# Altium schematic sheet Tray2_BCR.SchDoc: BLUEsat solar battery charge regulator subystem
size A2; Engineer: Thomas Fisk; Organization: BLUEsat Project; Address1: Room 419; Address2: School of EE&T; Address3: UNSW, NSW 2052; Address4: Australia; DocumentNumber: POWR0008; SheetNumber: 1; SheetTotal: 1; Description: Solar battery charge regulator subsystem.; Version: 2.6; PageSetup: Record=PageOptions|CenterHorizontal=True|CenterVertical=True|PrintScale=0.71|XCorrection=1.00|YCorrection=1.00|PrintKind=1|BorderSize=5000000|LeftOffset=0|BottomOffset=0|Orientation=2|PaperLength=2970|PaperWidth=2100|Scale=100|PaperSource=7|PrintQuality=1200|MediaType=1|DitherType=10|PaperKind=A4|PrintScaleMode=1
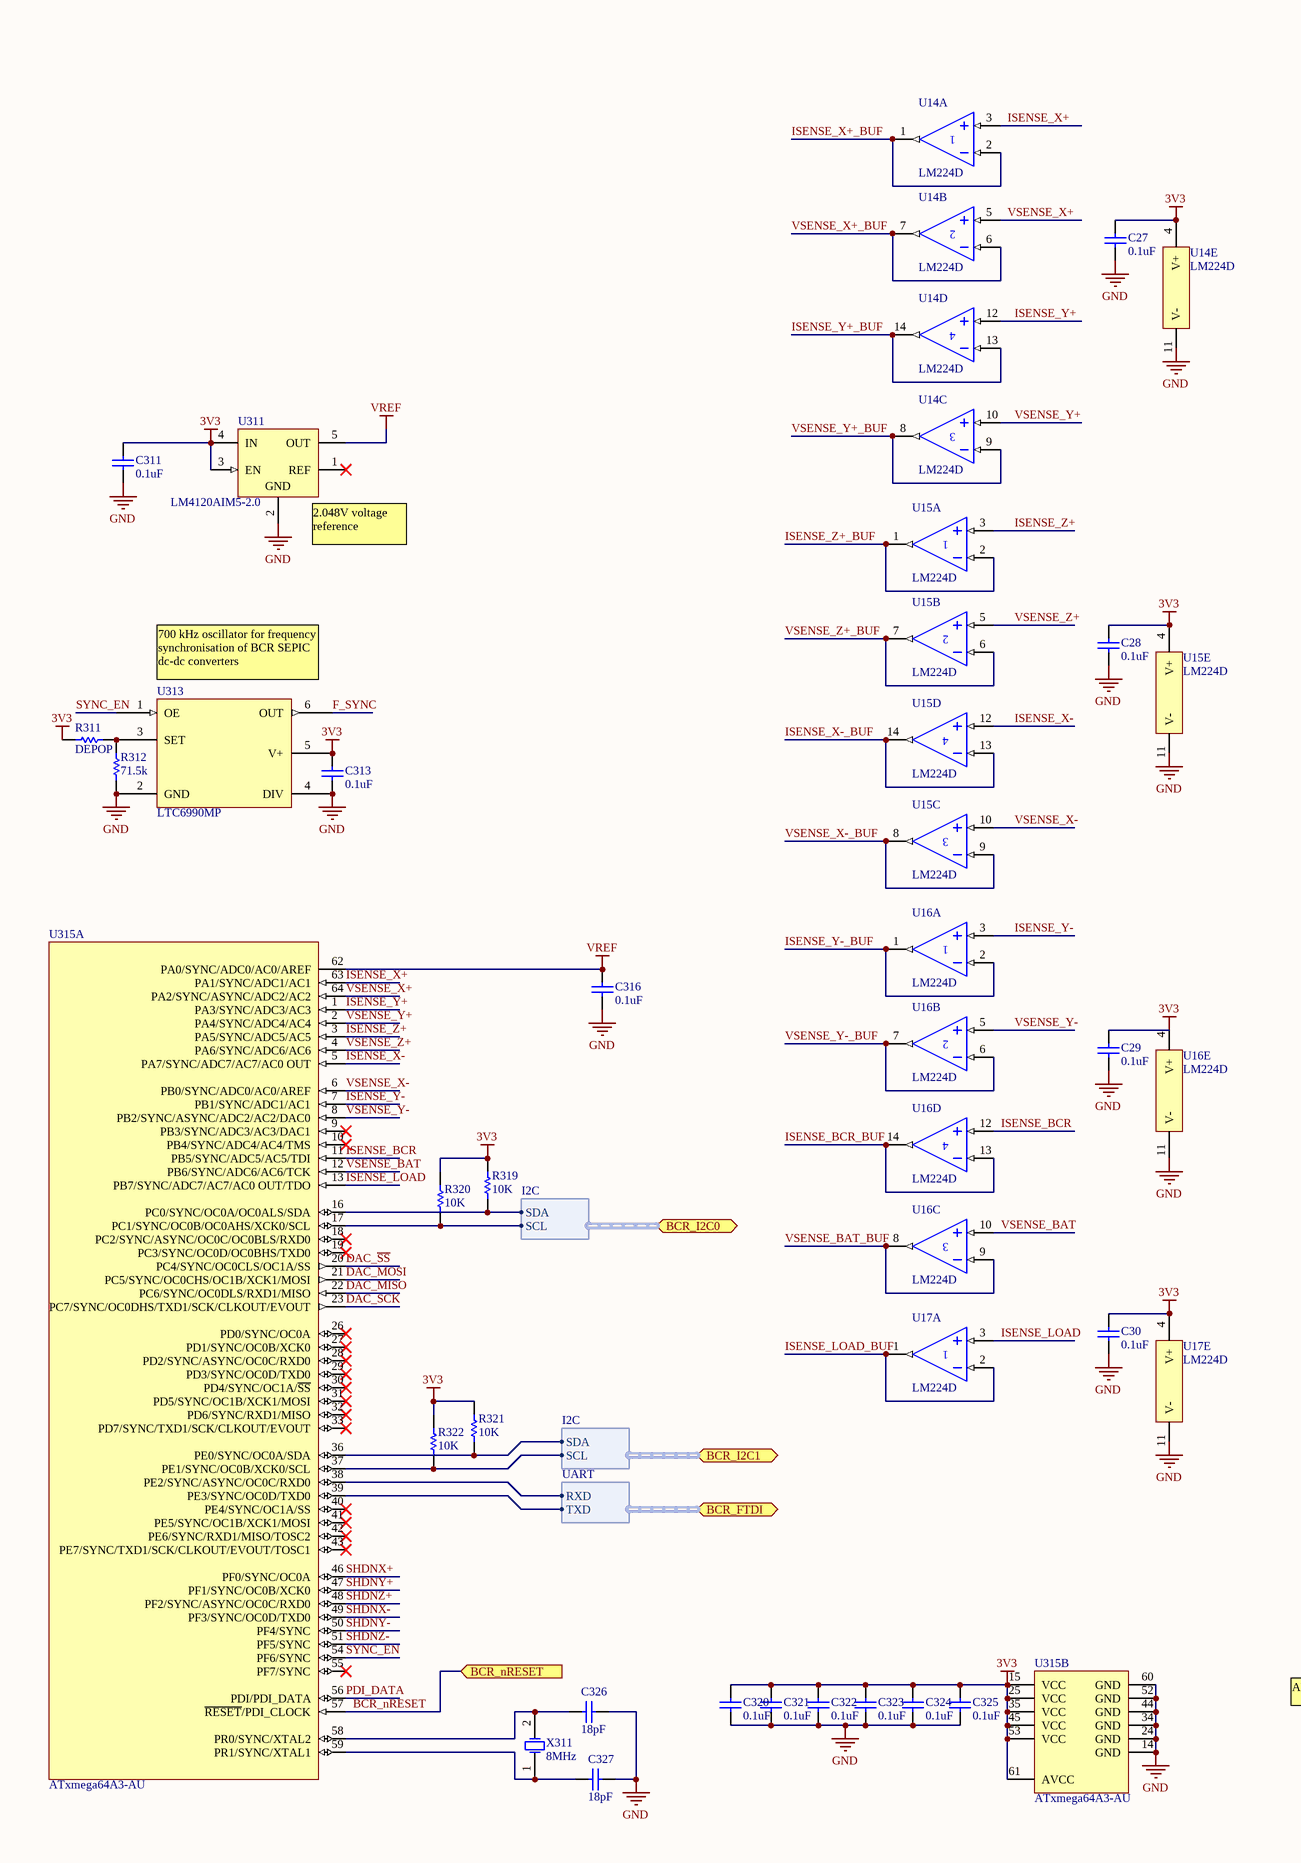
[diagram p0: Tray2_BCR.SchDoc, left]
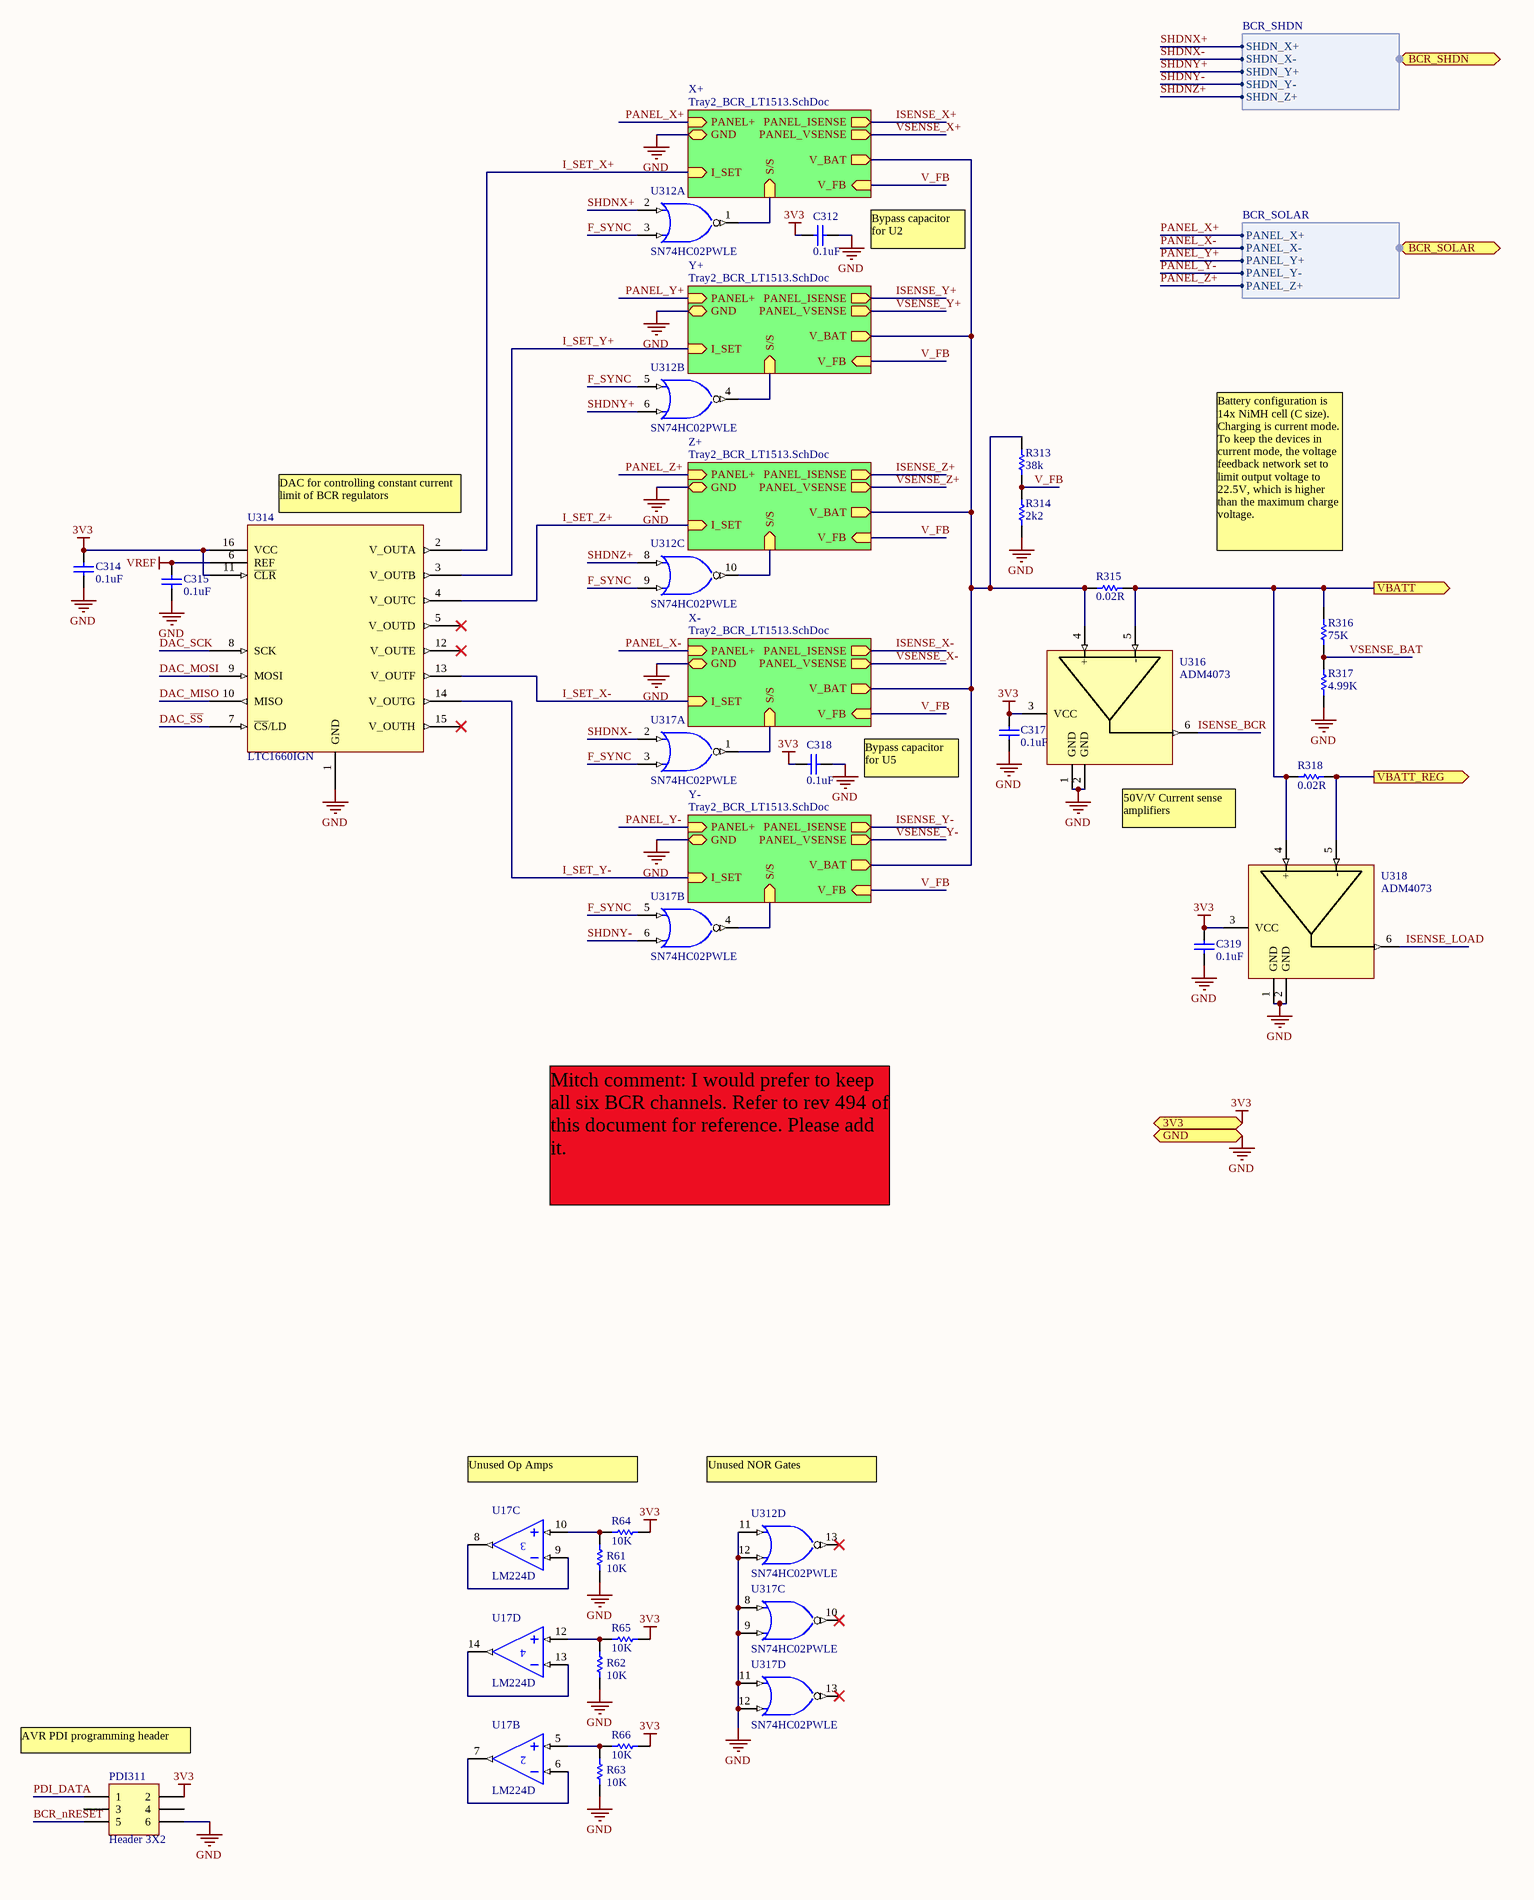
[diagram p1: Tray2_BCR.SchDoc, right]

## Parts
C27  value 0.1uF  [CAPC2012M]  (hidden comment: Cap)
C28  value 0.1uF  [CAPC2012M]  (hidden comment: Cap)
C29  value 0.1uF  [CAPC2012M]  (hidden comment: Cap)
C30  value 0.1uF  [CAPC2012M]  (hidden comment: Cap)
C311  value 0.1uF  [CAPC2012M]  (hidden comment: Cap)
C312  value 0.1uF  [CAPC2012M]  (hidden comment: Cap)
C313  value 0.1uF  [CAPC2012M]  (hidden comment: Cap)
C314  value 0.1uF  [CAPC2012M]  (hidden comment: Cap)
C315  value 0.1uF  [CAPC2012M]  (hidden comment: Cap)
C316  value 0.1uF  [CAPC2012M]  (hidden comment: Cap)
C317  value 0.1uF  [CAPC2012M]  (hidden comment: Cap)
C318  value 0.1uF  [CAPC2012M]  (hidden comment: Cap)
C319  value 0.1uF  [CAPC2012M]  (hidden comment: Cap)
C320  value 0.1uF  [CAPC2012M]  (hidden comment: Cap)
C321  value 0.1uF  [CAPC2012M]  (hidden comment: Cap)
C322  value 0.1uF  [CAPC2012M]  (hidden comment: Cap)
C323  value 0.1uF  [CAPC2012M]  (hidden comment: Cap)
C324  value 0.1uF  [CAPC2012M]  (hidden comment: Cap)
C325  value 0.1uF  [CAPC2012M]  (hidden comment: Cap)
C326  value 18pF  [CAPC2012M]  (hidden comment: Cap)
C327  value 18pF  [CAPC2012M]  (hidden comment: Cap)
PDI311  Header 3X2  [HDR2X3]
R61  value 10K  [RESC2012M]  (hidden comment: Res1)
R62  value 10K  [RESC2012M]  (hidden comment: Res1)
R63  value 10K  [RESC2012M]  (hidden comment: Res1)
R64  value 10K  [RESC2012M]  (hidden comment: Res1)
R65  value 10K  [RESC2012M]  (hidden comment: Res1)
R66  value 10K  [RESC2012M]  (hidden comment: Res1)
R311  value DEPOP  [RESC2012M]  (hidden comment: Res1)
R312  value 71.5k  [RESC2012M]  (hidden comment: Res1)
R313  value 38k  [RESC2012M]  (hidden comment: Res1)
R314  value 2k2  [RESC2012M]  (hidden comment: Res1)
R315  value 0.02R  [RESC2012M]  (hidden comment: 0805 Resistor)
R316  value 75K  [RESC2012M]  (hidden comment: Res1)
R317  value 4.99K  [RESC2012M]  (hidden comment: Res1)
R318  value 0.02R  [RESC2012M]  (hidden comment: 0805 Resistor)
R319  value 10K  [RESC2012M]  (hidden comment: Res1)
R320  value 10K  [RESC2012M]  (hidden comment: Res1)
R321  value 10K  [RESC2012M]  (hidden comment: Res1)
R322  value 10K  [RESC2012M]  (hidden comment: Res1)
U14  LM224D  [D014_N]  (parts A,B,C,D,E of 5)
U15  LM224D  [D014_N]  (parts A,B,C,D,E of 5)
U16  LM224D  [D014_N]  (parts A,B,C,D,E of 5)
U17  LM224D  [D014_N]  (parts A,B,C,D,E of 5)
U311  LM4120AIM5-2.0  [MF05A_N]
U312  SN74HC02PWLE  [TSOP65P640-14AN]  (parts A,B,C,D of 4)
U313  LTC6990MP  [SOT26A-6L]
U314  LTC1660IGN  [SOP635P600-16N]
U315  ATxmega64A3-AU  [64A_N]  (parts A,B of 2)
U316  ADM4073  [SOT26A-6N]
U317  SN74HC02PWLE  [TSOP65P640-14AN]  (parts A,B,C,D of 4)
U318  ADM4073  [SOT26A-6N]
X311  8MHz  [HC49 - No border]

## Sub-sheets
X+ = Tray2_BCR_LT1513.SchDoc: I_SET (in), V_BAT, S/S (in), V_FB (in), PANEL_VSENSE (out), PANEL_ISENSE (out), PANEL+ (in), GND
X- = Tray2_BCR_LT1513.SchDoc: I_SET (in), V_BAT, S/S (in), V_FB (in), PANEL_VSENSE (out), PANEL_ISENSE (out), PANEL+ (in), GND
Y+ = Tray2_BCR_LT1513.SchDoc: I_SET (in), V_BAT, S/S (in), V_FB (in), PANEL_VSENSE (out), PANEL_ISENSE (out), PANEL+ (in), GND
Y- = Tray2_BCR_LT1513.SchDoc: I_SET (in), V_BAT, S/S (in), V_FB (in), PANEL_VSENSE (out), PANEL_ISENSE (out), PANEL+ (in), GND
Z+ = Tray2_BCR_LT1513.SchDoc: I_SET (in), V_BAT, S/S (in), V_FB (in), PANEL_VSENSE (out), PANEL_ISENSE (out), PANEL+ (in), GND

## Ports
3V3, BCR_FTDI (harness UART), BCR_I2C0 (harness I2C), BCR_I2C1 (harness I2C), BCR_nRESET (in), BCR_SHDN (harness BCR_SHDN), BCR_SOLAR (harness BCR_SOLAR), GND, VBATT (out), VBATT_REG (out)

## Harnesses
BCR_SHDN: SHDN_X+, SHDN_X-, SHDN_Y+, SHDN_Y-, SHDN_Z+
I2C: SCL, SDA
UART: RXD, TXD
BCR_SOLAR: PANEL_X+, PANEL_X-, PANEL_Y+, PANEL_Y-, PANEL_Z+

## Nets
3V3: C27.1 C28.1 C29.1 C30.1 C311.2 C312.2 C313.1 C314.2 C317.1 C318.2 C319.1 C320.2 C321.2 C322.2 C323.2 C324.2 C325.2 PDI311.2 R64.2 R65.2 R66.2 R311.1 R319.1 R320.1 R321.1 R322.1 U14.4(V+) U15.4(V+) U17.4(V+) U311.3(EN) U311.4(IN) U313.5(V+) U314.11(~{CLR}) U314.16(VCC) U315.15(VCC) U315.25(VCC) U315.35(VCC) U315.45(VCC) U315.53(VCC) U315.61(AVCC) U316.3(VCC) U318.3(VCC) ; port 3V3
GND: C27.2 C28.2 C29.2 C30.2 C311.1 C312.1 C313.2 C314.1 C315.1 C316.1 C317.2 C318.1 C319.2 C320.1 C321.1 C322.1 C323.1 C324.1 C325.1 C326.2 C327.1 PDI311.6 R61.2 R62.2 R63.2 R312.1 R314.1 R317.2 U16.11(V-) U311.2(GND) U312.7(GND) U312.11(A) U312.12(B) U313.2(GND) U313.4(DIV) U314.1(GND) U315.14(GND) U315.24(GND) U315.34(GND) U315.44(GND) U315.52(GND) U315.60(GND) U316.1(GND) U316.2(GND) U317.7(GND) U317.8(A) U317.9(B) U317.11(A) U317.12(B) U318.1(GND) U318.2(GND) ; port GND, sheet X+/GND, sheet Y+/GND, sheet Z+/GND, sheet X-/GND, sheet Y-/GND
VCC: U312.14(VCC) U317.14(VCC)
VREF: C315.2 C316.2 U311.5(OUT) U314.6(REF) U315.62(PA0/SYNC/ADC0/AC0/AREF)
BCR_nRESET: PDI311.5 U315.57(~{RESET}/PDI_CLOCK) ; port BCR_nRESET
DAC_MISO: U314.10(MISO) U315.22(PC6/SYNC/OC0DLS/RXD1/MISO)
DAC_MOSI: U314.9(MOSI) U315.21(PC5/SYNC/OC0CHS/OC1B/XCK1/MOSI)
DAC_~{SS}: U314.7(~{CS}/LD) U315.20(PC4/SYNC/OC0CLS/OC1A/SS)
DAC_SCK: U314.8(SCK) U315.23(PC7/SYNC/OC0DHS/TXD1/SCK/CLKOUT/EVOUT)
F_SYNC: U312.3(B) U312.5(A) U312.9(B) U313.6(OUT) U317.3(B) U317.5(A)
I_SET_X+: U314.2(V_OUTA) ; sheet X+/I_SET
I_SET_X-: U314.13(V_OUTF) ; sheet X-/I_SET
I_SET_Y+: U314.3(V_OUTB) ; sheet Y+/I_SET
I_SET_Y-: U314.14(V_OUTG) ; sheet Y-/I_SET
I_SET_Z+: U314.4(V_OUTC) ; sheet Z+/I_SET
ISENSE_BCR: U16.12(IN+) U315.11(PB5/SYNC/ADC5/AC5/TDI) U316.6
ISENSE_BCR_BUF: U16.13(IN-) U16.14(OUT)
ISENSE_LOAD: U17.3(IN+) U315.13(PB7/SYNC/ADC7/AC7/AC0_OUT/TDO) U318.6
ISENSE_LOAD_BUF: U17.1(OUT) U17.2(IN-)
ISENSE_X+: U14.3(IN+) U315.63(PA1/SYNC/ADC1/AC1) ; sheet X+/PANEL_ISENSE
ISENSE_X+_BUF: U14.1(OUT) U14.2(IN-)
ISENSE_X-: U15.12(IN+) U315.5(PA7/SYNC/ADC7/AC7/AC0_OUT) ; sheet X-/PANEL_ISENSE
ISENSE_X-_BUF: U15.13(IN-) U15.14(OUT)
ISENSE_Y+: U14.12(IN+) U315.1(PA3/SYNC/ADC3/AC3) ; sheet Y+/PANEL_ISENSE
ISENSE_Y+_BUF: U14.13(IN-) U14.14(OUT)
ISENSE_Y-: U16.3(IN+) U315.7(PB1/SYNC/ADC1/AC1) ; sheet Y-/PANEL_ISENSE
ISENSE_Y-_BUF: U16.1(OUT) U16.2(IN-)
ISENSE_Z+: U15.3(IN+) U315.3(PA5/SYNC/ADC5/AC5) ; sheet Z+/PANEL_ISENSE
ISENSE_Z+_BUF: U15.1(OUT) U15.2(IN-)
PANEL_X+: sheet X+/PANEL+, port BCR_SOLAR.PANEL_X+
PANEL_X-: sheet X-/PANEL+, port BCR_SOLAR.PANEL_X-
PANEL_Y+: sheet Y+/PANEL+, port BCR_SOLAR.PANEL_Y+
PANEL_Y-: sheet Y-/PANEL+, port BCR_SOLAR.PANEL_Y-
PANEL_Z+: sheet Z+/PANEL+, port BCR_SOLAR.PANEL_Z+
PDI_DATA: PDI311.1 U315.56(PDI/PDI_DATA)
SHDNX+: U312.2(A) U315.46(PF0/SYNC/OC0A) ; port BCR_SHDN.SHDN_X+
SHDNX-: U315.49(PF3/SYNC/OC0D/TXD0) U317.2(A) ; port BCR_SHDN.SHDN_X-
SHDNY+: U312.6(B) U315.47(PF1/SYNC/OC0B/XCK0) ; port BCR_SHDN.SHDN_Y+
SHDNY-: U315.50(PF4/SYNC) U317.6(B) ; port BCR_SHDN.SHDN_Y-
SHDNZ+: U312.8(A) U315.48(PF2/SYNC/ASYNC/OC0C/RXD0) ; port BCR_SHDN.SHDN_Z+
SHDNZ-: U315.51(PF5/SYNC)
SYNC_EN: U313.1(OE) U315.54(PF6/SYNC)
V_FB: R313.1 R314.2 ; sheet X+/V_FB, sheet Y+/V_FB, sheet Z+/V_FB, sheet X-/V_FB, sheet Y-/V_FB
VBATT: R315.2 R316.1 R318.2 U316.5(-) U318.4(+) ; port VBATT
VBATT_REG: R318.1 U318.5(-) ; port VBATT_REG
VSENSE_BAT: R316.2 R317.1 U16.10(IN+) U315.12(PB6/SYNC/ADC6/AC6/TCK)
VSENSE_BAT_BUF: U16.8(OUT) U16.9(IN-)
VSENSE_X+: U14.5(IN+) U315.64(PA2/SYNC/ASYNC/ADC2/AC2) ; sheet X+/PANEL_VSENSE
VSENSE_X+_BUF: U14.6(IN-) U14.7(OUT)
VSENSE_X-: U15.10(IN+) U315.6(PB0/SYNC/ADC0/AC0/AREF) ; sheet X-/PANEL_VSENSE
VSENSE_X-_BUF: U15.8(OUT) U15.9(IN-)
VSENSE_Y+: U14.10(IN+) U315.2(PA4/SYNC/ADC4/AC4) ; sheet Y+/PANEL_VSENSE
VSENSE_Y+_BUF: U14.8(OUT) U14.9(IN-)
VSENSE_Y-: U16.5(IN+) U315.8(PB2/SYNC/ASYNC/ADC2/AC2/DAC0) ; sheet Y-/PANEL_VSENSE
VSENSE_Y-_BUF: U16.6(IN-) U16.7(OUT)
VSENSE_Z+: U15.5(IN+) U315.4(PA6/SYNC/ADC6/AC6) ; sheet Z+/PANEL_VSENSE
VSENSE_Z+_BUF: U15.6(IN-) U15.7(OUT)
NetC326_1: C326.1 U315.58(PR0/SYNC/XTAL2) X311.2(OSC2)
NetC327_2: C327.2 U315.59(PR1/SYNC/XTAL1) X311.1(OSC1)
NetR61_1: R61.1 R64.1 U17.10(IN+)
NetR62_1: R62.1 R65.1 U17.12(IN+)
NetR63_1: R63.1 R66.1 U17.5(IN+)
NetR311_2: R311.2 R312.2 U313.3(SET)
NetR313_2: R313.2 R315.1 U316.4(+) ; sheet X+/V_BAT, sheet Y+/V_BAT, sheet Z+/V_BAT, sheet X-/V_BAT, sheet Y-/V_BAT
NetR319_2: R319.2 U315.16(PC0/SYNC/OC0A/OC0ALS/SDA) ; port BCR_I2C0.SDA
NetR320_2: R320.2 U315.17(PC1/SYNC/OC0B/OC0AHS/XCK0/SCL) ; port BCR_I2C0.SCL
NetR321_2: R321.2 U315.36(PE0/SYNC/OC0A/SDA) ; port BCR_I2C1.SDA
NetR322_2: R322.2 U315.37(PE1/SYNC/OC0B/XCK0/SCL) ; port BCR_I2C1.SCL
NetU17_6: U17.6(IN-) U17.7(OUT)
NetU17_8: U17.8(OUT) U17.9(IN-)
NetU17_13: U17.13(IN-) U17.14(OUT)
NetU312_1: U312.1(Y) ; sheet X+/S/S
NetU312_4: U312.4(Y) ; sheet Y+/S/S
NetU312_10: U312.10(Y) ; sheet Z+/S/S
NetU315_38: U315.38(PE2/SYNC/ASYNC/OC0C/RXD0) ; port BCR_FTDI.RXD
NetU315_39: U315.39(PE3/SYNC/OC0D/TXD0) ; port BCR_FTDI.TXD
NetU317_1: U317.1(Y) ; sheet X-/S/S
NetU317_4: U317.4(Y) ; sheet Y-/S/S

Not connected (* = marked no-connect by the designer): PDI311 3 4; U14 11(V-); U15 11(V-); U16 4(V+); U17 11(V-); U311 1(REF)*; U312 13(Y)*; U314 5(V_OUTD)* 12(V_OUTE)* 15(V_OUTH)*; U315 9(PB3/SYNC/ADC3/AC3/DAC1)* 10(PB4/SYNC/ADC4/AC4/TMS)* 18(PC2/SYNC/ASYNC/OC0C/OC0BLS/RXD0)* 19(PC3/SYNC/OC0D/OC0BHS/TXD0)* 26(PD0/SYNC/OC0A)* 27(PD1/SYNC/OC0B/XCK0)* 28(PD2/SYNC/ASYNC/OC0C/RXD0)* 29(PD3/SYNC/OC0D/TXD0)* 30(PD4/SYNC/OC1A/~{SS})* 31(PD5/SYNC/OC1B/XCK1/MOSI)* 32(PD6/SYNC/RXD1/MISO)* 33(PD7/SYNC/TXD1/SCK/CLKOUT/EVOUT)* 40(PE4/SYNC/OC1A/SS)* 41(PE5/SYNC/OC1B/XCK1/MOSI)* 42(PE6/SYNC/RXD1/MISO/TOSC2)* 43(PE7/SYNC/TXD1/SCK/CLKOUT/EVOUT/TOSC1)* 55(PF7/SYNC)*; U317 10(Y)* 13(Y)*

## Notes on the sheet
- (near C312) Bypass capacitor for U2
- (near U314) DAC for controlling constant current limit of BCR regulators
- Battery configuration is 14x NiMH cell (C size). Charging is current mode. To keep the devices in current mode, the voltage feedback network set to limit output voltage to 22.5V, which is higher than the maximum charge voltage.
- (near U311) 2.048V voltage reference
- (near U313) 700 kHz oscillator for frequency synchronisation of BCR SEPIC dc-dc converters
- Bypass capacitor for U5
- 50V/V Current sense amplifiers
- Mitch comment: I would prefer to keep all six BCR channels. Refer to rev 494 of this document for reference. Please add it.
- Unused Op Amps
- Unused NOR Gates
- (near PDI311) AVR PDI programming header
- Labels drawn without touching a wire or pin: GND
- Title
- Size:
- Date:
- File:
- A2
- Number:
- Time:
- Revision:
- Sheet
- of

## Library data of the parts
C27-C30 C311-C327 = Cap: Capacitor; Published: 8-Jun-2000; LatestRevisionDate: 17-Jul-2002; LatestRevisionNote: Re-released for DXP Platform.; PackageReference: RAD-0.3; Publisher: Altium Limited; PackageDescription: Radial Cap, Thru-Hole; 2 Leads; 0.3 in Pin Spacing; Supplier 1: Farnell; Supplier 2: Farnell; Supplier Part Number 2: 1759265
PDI311 = Header 3X2: Header, 3-Pin, Dual row; LatestRevisionDate: 17-Jul-2002; LatestRevisionNote: Re-released for DXP Platform.; Publisher: Altium Limited
R61-R66 R311-R322 = Res1: Resistor; Published: 8-Jun-2000; LatestRevisionDate: 17-Jul-2002; LatestRevisionNote: Re-released for DXP Platform.; PackageReference: AXIAL-0.3; Publisher: Altium Limited; PackageDescription: Axial Device, Thru-Hole; 2 Leads; 0.3 in Pin Spacing; Supplier 1: Farnell
U14-U17 = LM224D: Quadruple Operational Amplifier; Published: 15-Apr-2002; LatestRevisionDate: 13-Apr-2006; LatestRevisionNote: IPC-7351 Footprint Added.; DatasheetVersion: Jan-1989; PackageVersion: Jan-1998; PackageReference: D014; Publisher: Altium Limited; PackageDescription: 14-Pin Small Outline Integrated Circuit 1.27 mm Pitch; Code_IPC: SOIC127P600-14; ComponentLink1Description: Manufacturer Link; ComponentLink1URL: http://www.ti.com/; ComponentLink2Description: Datasheet; ComponentLink2URL: http://www-s.ti.com/sc/ds/lm224.pdf
U311 = LM4120AIM5-2.0: Precision Micropower Low Dropout Voltage Reference; Manufacturer: National Semiconductor; CompType: Voltage Reference IC; PackageTopMarking: R14A*XTT; PowerWise: Y; Published: 4-Dec-2008; DatasheetVersion: Mar-2005; PackageVersion: revD, Aug-2008; PackageReference: MF05A; Publisher: Altium Limited; PackageDescription: Molded SOT-23, .115 x .063 x .040 in Body, 5 Lead, .0375 in Pitch; PartNumber: LM4120AIM5-2.0; RoHS: O; PinCount: 5; DigiKeyPartNumber: LM4120AIM5-2.0CT-ND; ComponentLink1Description: LM4120 Datasheet; ComponentLink1URL: http://www.national.com/ds/LM/LM4120.pdf; ComponentLink2Description: LM4120 Web Page; ComponentLink2URL: http://www.national.com/pf/LM/LM4120.html; ComponentLink3Description: MF05A Package Page; ComponentLink3URL: http://www.national.com/packaging/folders/mf05a.html
U312 U317 = SN74HC02PWLE: Quadruple 2-Input Positive-NOR Gate; Published: 8-Jun-2000; LatestRevisionDate: 04-Mar-2005; LatestRevisionNote: Stylized 3D Model Added.; DatasheetVersion: May-1997; PackageVersion: Feb-1999; PackageReference: PW014; Publisher: Altium Limited; PackageDescription: Shrink Small Outline; 14 Leads; Body Width 4.4 mm; Pitch 0.65 mm; ComponentLink1Description: Manufacturer Link; ComponentLink1URL: http://www.ti.com/; ComponentLink2Description: Datasheet; ComponentLink2URL: http://www-s.ti.com/sc/ds/sn74hc02.pdf
U315 = ATxmega64A3-AU: 8/16-bit AVR XMEGA A3 Microcontroller, 1.6-3.6V, 32MHz, 64KB + 4KB Flash, 2KB EEPROM, 4KB SRAM, 64-pin TQFP, Industrial Grade (-40°C to 85°C), Pb-Free; DatasheetVersion: revT, Dec-2010; PackageVersion: revC, Oct-2010; PackageReference: 64A; PackageDescription: 64-Pin Plastic Thin Profile Quad Flat Pack, 14 x 14 x 1.0 mm Body, 0.8 mm Pitch (TQFP); Code_JEDEC: MS-026-AEB; ComponentLink1Description: Manufacturer URL; ComponentLink1URL: http://www.atmel.com/; ComponentLink2Description: ATxmega64A3/128A3/192A3/256A3 Datasheet; ComponentLink2URL: http://www.atmel.com/dyn/resources/prod_documents/doc8068.pdf
U316 U318 = ADM4073: Current Sense Amplifer
X311 = XTAL: Crystal Oscillator; Published: 8-Jun-2000; LatestRevisionDate: 17-Jul-2002; LatestRevisionNote: Re-released for DXP Platform.; PackageReference: R38; Publisher: Altium Limited; PackageDescription: Crystal, Thru-Hole; 2 Leads; Body 3.1 x 8.2 mm (Dia.xH)